# EAGLE design cyrf69103-tinyRF (EAGLE 6.4)
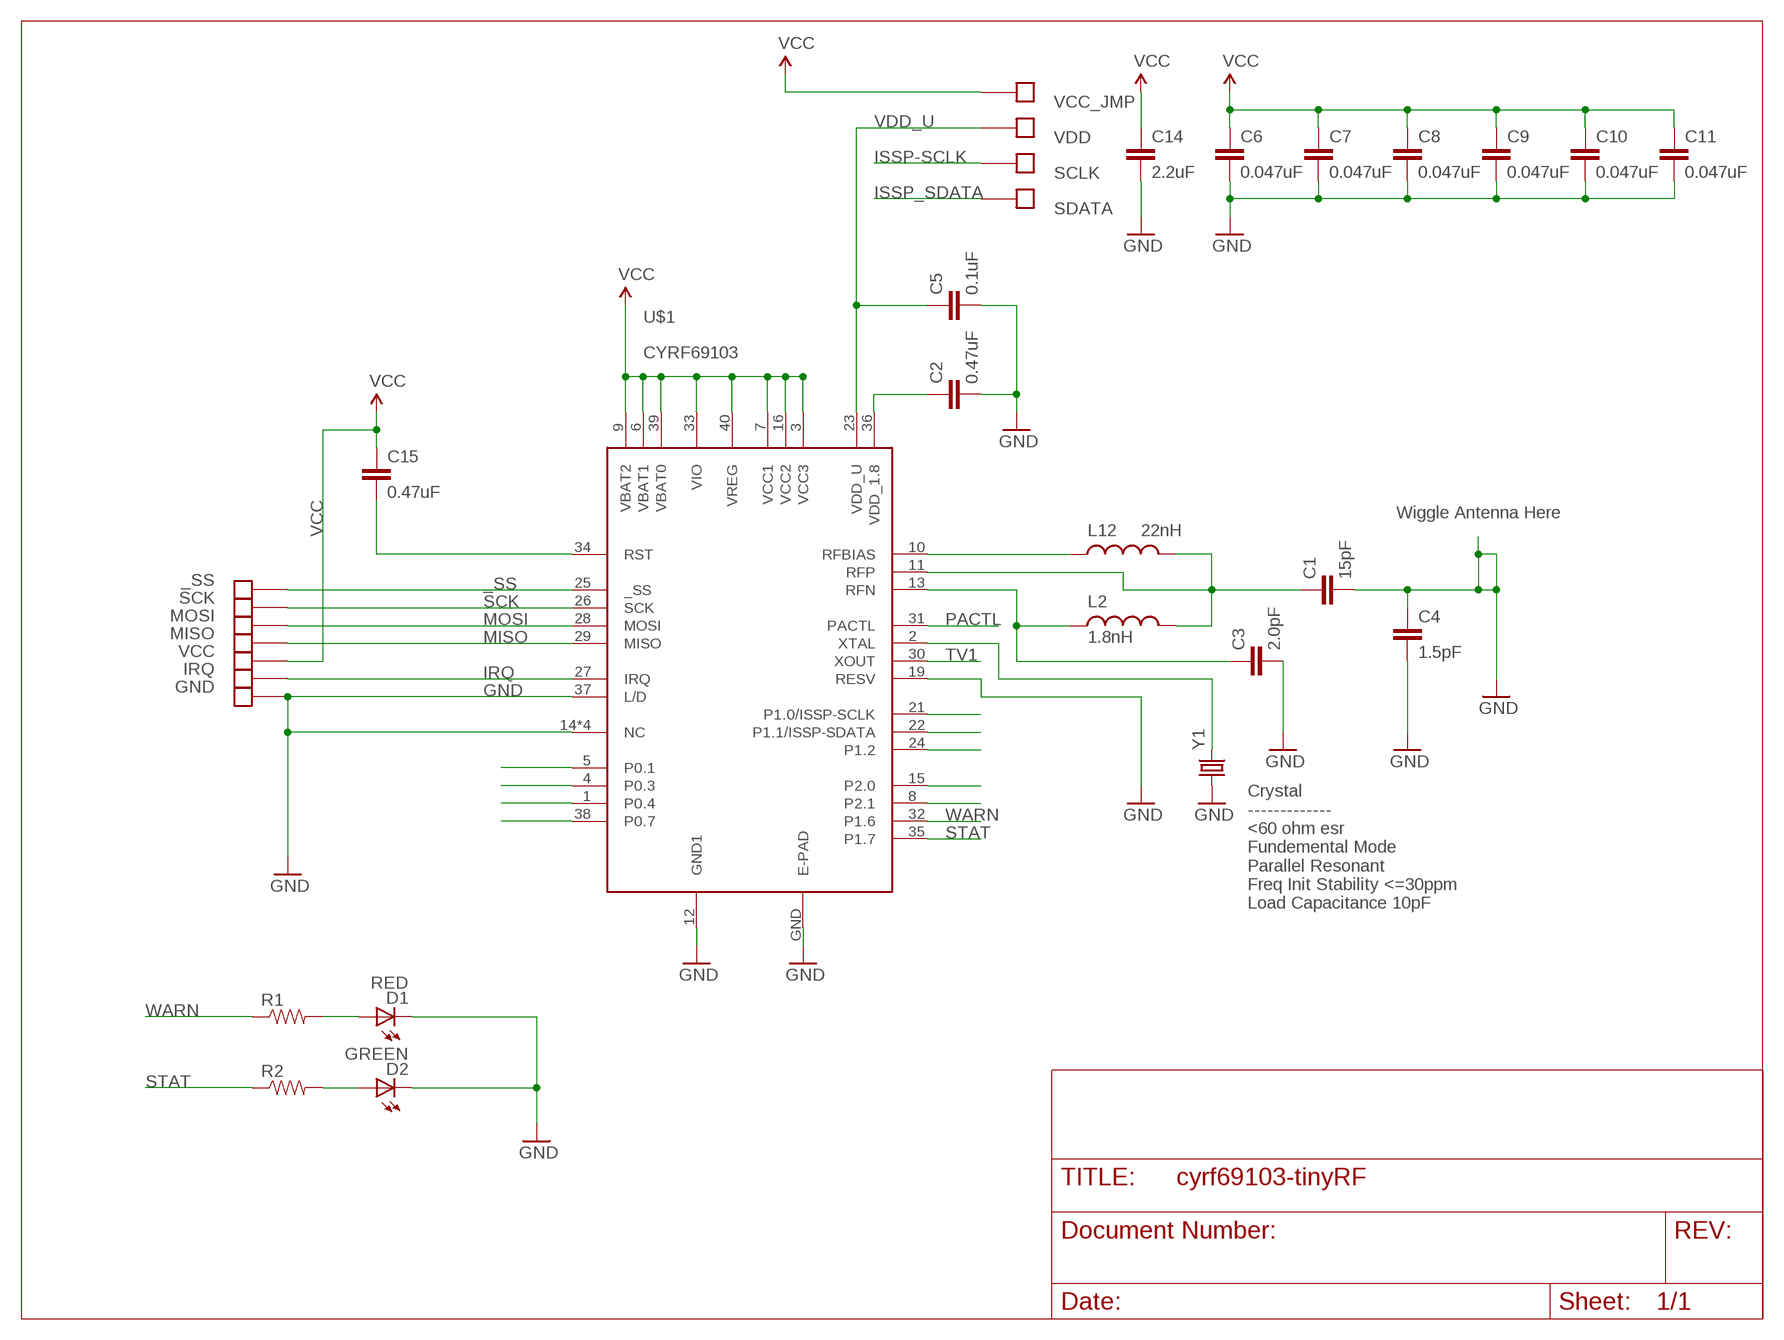
[diagram p0: schematic, sheet 1]

## Parts
_SS  SOLDER_PAD.05X.05  [SOLDER_PAD_.05X.05]
C1  15pF  CAP0402-CAP  [0402-CAP]
C2  0.47uF  CAP0402-CAP  [0402-CAP]
C3  2.0pF  CAP0402-CAP  [0402-CAP]
C4  1.5pF  CAP0402-CAP  [0402-CAP]
C5  0.1uF  CAP0402-CAP  [0402-CAP]
C6  0.047uF  CAP0402-CAP  [0402-CAP]
C7  0.047uF  CAP0402-CAP  [0402-CAP]
C8  0.047uF  CAP0402-CAP  [0402-CAP]
C9  0.047uF  CAP0402-CAP  [0402-CAP]
C10  0.047uF  CAP0402-CAP  [0402-CAP]
C11  0.047uF  CAP0402-CAP  [0402-CAP]
C14  2.2uF  CAP0805  [0805]
C15  0.47uF  CAP0402-CAP  [0402-CAP]
D1  RED  LED-RED0603  [LED-0603]
D2  GREEN  LED-GREEN0603  [LED-0603]
GND  SOLDER_PAD.05X.05  [SOLDER_PAD_.05X.05]
IRQ  SOLDER_PAD.05X.05  [SOLDER_PAD_.05X.05]
L2  1.8nH  INDUCTOR0402  [C0402]
L12  22nH  INDUCTOR0603  [0603]
MISO  SOLDER_PAD.05X.05  [SOLDER_PAD_.05X.05]
MOSI  SOLDER_PAD.05X.05  [SOLDER_PAD_.05X.05]
R1  RESISTOR0402-RES  [0402-RES]
R2  RESISTOR0402-RES  [0402-RES]
SCK  SOLDER_PAD.05X.05  [SOLDER_PAD_.05X.05]
SCLK  SOLDER_PAD.05X.05  [SOLDER_PAD_.05X.05]
SDATA  SOLDER_PAD.05X.05  [SOLDER_PAD_.05X.05]
U$1  CYRF69103  [QFN40]
VCC  SOLDER_PAD.05X.05  [SOLDER_PAD_.05X.05]
VCC_JMP  SOLDER_PAD.05X.05  [SOLDER_PAD_.05X.05]
VDD  SOLDER_PAD.05X.05  [SOLDER_PAD_.05X.05]
Y1  CRYSTAL5X3  [CRYSTAL-SMD-5X3]

## Nets
_SS: _SS.P$1(NET) U$1.25(_SS)
GND: C1.2 C2.2 C3.2 C4.1 C4.2 C5.2 C6.2 C7.2 C8.2 C9.2 C10.2 C11.2 C14.2 D1.C D2.C GND.P$1(NET) U$1.12(GND1) U$1.14(NC) U$1.17(NC) U$1.18(NC) U$1.20(NC) U$1.37(L/D) U$1.GND(E-PAD) Y1.1
IRQ: IRQ.P$1(NET) U$1.27(IRQ)
ISSP-SCLK: SCLK.P$1(NET) U$1.21(P1.0/ISSP-SCLK)
ISSP_SDATA: SDATA.P$1(NET) U$1.22(P1.1/ISSP-SDATA)
MISO: MISO.P$1(NET) U$1.29(MISO)
MOSI: MOSI.P$1(NET) U$1.28(MOSI)
N$1: D1.A R1.2
N$2: U$1.2(XTAL) Y1.3
N$3: U$1.5(P0.1)
N$4: U$1.4(P0.3)
N$5: U$1.1(P0.4)
N$6: U$1.38(P0.7)
N$7: U$1.24(P1.2)
N$8: U$1.15(P2.0)
N$9: U$1.8(P2.1)
N$10: D2.A R2.2
PACTL: U$1.31(PACTL)
RFBIAS: L12.1 U$1.10(RFBIAS)
RFN: C3.1 L2.1 U$1.13(RFN)
RFP: C1.1 L2.2 L12.2 U$1.11(RFP)
RST: C15.2 U$1.34(RST)
SCK: SCK.P$1(NET) U$1.26(SCK)
STAT: R2.1 U$1.35(P1.7)
VCC: C6.1 C7.1 C8.1 C9.1 C10.1 C11.1 C14.1 C15.1 U$1.3(VCC3) U$1.6(VBAT1) U$1.7(VCC1) U$1.9(VBAT2) U$1.16(VCC2) U$1.33(VIO) U$1.39(VBAT0) U$1.40(VREG) VCC.P$1(NET) VCC_JMP.P$1(NET)
VDD_1.8: C2.1 U$1.36(VDD_1.8)
VDD_U: C5.1 U$1.23(VDD_U) VDD.P$1(NET)
WARN: R1.1 U$1.32(P1.6)
Unconnected: U$1.19(RESV) U$1.30(XOUT)

## Notes on the sheet
- Wiggle Antenna Here
- Crystal
  -------------
  <60 ohm esr
  Fundemental Mode
  Parallel Resonant
  Freq Init Stability <=30ppm
  Load Capacitance 10pF

## Library data of the parts
_SS GND IRQ MISO MOSI SCK SCLK SDATA VCC VCC_JMP VDD = JCM:SOLDER_PAD
C1 = SparkFun-Passives:CAP: Capacitor Standard 0603 ceramic capacitor, and 0.1" leaded capacitor.; PARTNO: C0402C150J5GACTU; VOLT: 50
C2 C5 C15 = SparkFun-Passives:CAP: Capacitor Standard 0603 ceramic capacitor, and 0.1" leaded capacitor.; PARTNO: GRM155R60J474KE19D; VOLT: 6.3
C3 = SparkFun-Passives:CAP: Capacitor Standard 0603 ceramic capacitor, and 0.1" leaded capacitor.; PARTNO: C0402C209C5GACTU; VOLT: 50
C4 = SparkFun-Passives:CAP: Capacitor Standard 0603 ceramic capacitor, and 0.1" leaded capacitor.; PARTNO: C0402C159B5GACTU; VOLT: 50
C6-C11 = SparkFun-Passives:CAP: Capacitor Standard 0603 ceramic capacitor, and 0.1" leaded capacitor.; PARTNO: 0402YD473KAT2A
C14 = SparkFun-Passives:CAP: Capacitor Standard 0603 ceramic capacitor, and 0.1" leaded capacitor.; PARTNO: GRM21BR71A225KA01L
D1 = SparkFun-LED:LED-RED: Assorted Red LEDs LilyPad 1206- DIO-09912 1206- DIO-00809 0603- DIO-00819; PROD_ID: DIO-00819
D2 = SparkFun-LED:LED-GREEN: Various green LEDs 0603- DIO-00821 LARGE- DIO-00862 LILYPAD- DIO-09910; PROD_ID: DIO-00821
L2 = SparkFun-Passives:INDUCTOR: Inductors Basic Inductor/Choke - 0603 and 1206. Footprints are not proven and vary greatly between part numbers.; PARTNO: ELJ-RF1N8DFB
L12 = SparkFun-Passives:INDUCTOR: Inductors Basic Inductor/Choke - 0603 and 1206. Footprints are not proven and vary greatly between part numbers.; PARTNO: ELJ-RE22NGFA
R1 R2 = SparkFun-Passives:RESISTOR: Resistor Basic schematic elements and footprints for 0603, 1206, and PTH resistors.
U$1 = JCM:CYRF69103
Y1 = SparkFun-FreqCtrl:CRYSTAL: Various standard crystals. Proven footprints. Spark Fun Electronics SKU : COM-00534; PARTNO: 7B-12.000MEEQ-T

## Board
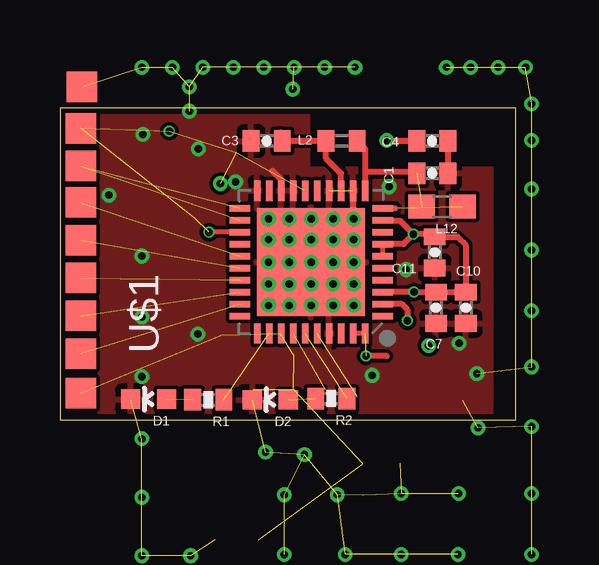
[diagram p1: board, top side]
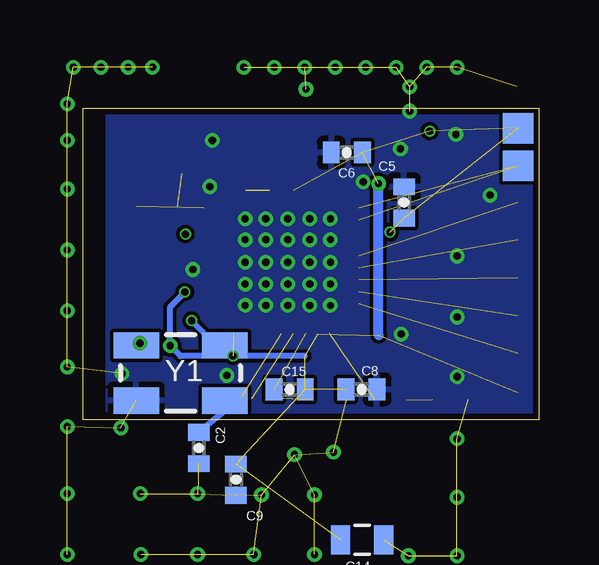
[diagram p2: board, bottom side, seen from below]

Size 19 x 13 mm. Coordinates in mm from the lower left corner, seen from the top.
Outline: 0,0 19,0 19,13 0,13 0,0
Copper layers (1*16): Top 0.035mm / dielectric 1.5mm / Bottom 0.035mm
Design rules "Fusion_eagle_rule_v1.1-JCM-restring *": minimum track width 6mil, minimum drill 12mil, track to track 6mil, track to pad 6mil, pad to pad 6mil, via to via 6mil, smd to smd 0mil, copper to edge 10mil, drill to drill 10mil, minimum pad ring 10mil, minimum via ring 2mil, stop-mask expansion 2mil, vias tented up to drill 100mil, thermal gap 10mil
tRestrict: area 10.4,10.6 to 18.8,14; area 14.1,13.4 to 15.6,15.2
bRestrict: area 14.1,15.1 to 16.9,16.7

### Footprints (pad centres in the part's own frame; a part is rotated, then mirrored left to right if it is on the bottom)
SOLDER_PAD_.05X.05 = smd 1.27 x 1.27: P$1 0,0
0402-CAP = smd 0.7 x 0.9: 1 -0.65,0; 2 0.65,0
0805 = smd 0.8 x 1.2: 1 -0.9,0; 2 0.9,0
LED-0603 = smd 0.8 x 0.8: A 0,-0.75; C 0,0.75
C0402 = smd 0.7 x 0.9: 1 -0.65,0; 2 0.65,0
0603 = smd 1.1 x 1: 1 -0.85,0; 2 0.85,0
0402-RES = smd 0.7 x 0.9: 1 -0.65,0; 2 0.65,0
QFN40 = smd 0.28 x 0.85: 1 -2.25,-2.975; 2 -1.75,-2.975; 3 -1.25,-2.975; 4 -0.75,-2.975; 5 -0.25,-2.975; 6 0.25,-2.975; 7 0.75,-2.975; 8 1.25,-2.975; 9 1.75,-2.975; 10 2.25,-2.975; 21 2.25,2.975; 22 1.75,2.975; 23 1.25,2.975; 24 0.75,2.975; 25 0.25,2.975; 26 -0.25,2.975; 27 -0.75,2.975; 28 -1.25,2.975; 29 -1.75,2.975; 30 -2.25,2.975 | smd 0.85 x 0.28: 11 2.975,-2.25; 12 2.975,-1.75; 13 2.975,-1.25; 14 2.975,-0.75; 15 2.975,-0.25; 16 2.975,0.25; 17 2.975,0.75; 18 2.975,1.25; 19 2.975,1.75; 20 2.975,2.25; 31 -2.975,2.25; 32 -2.975,1.75; 33 -2.975,1.25; 34 -2.975,0.75; 35 -2.975,0.25; 36 -2.975,-0.25; 37 -2.975,-0.75; 38 -2.975,-1.25; 39 -2.975,-1.75; 40 -2.975,-2.25 | smd 4.5 x 4.5: GND 0,0
CRYSTAL-SMD-5X3 = smd 1.9 x 1.1: 1 -1.85,-1.15; 2 1.85,-1.15; 3 1.85,1.15; 4 -1.85,1.15

### Placement (x,y rotation side)
_SS  0.87,9.06 0 top
C1  15.53,10.28 0 top
C2  14.18,-1.17 270 bottom
C3  8.62,11.63 180 top
C4  15.53,11.63 180 top
C5  5.62,9.06 90 bottom
C6  8.01,11.15 180 bottom
C7  15.68,4.67 270 top
C8  7.4,1.27 0 bottom
C9  12.63,-2.49 270 bottom
C10  16.93,4.67 270 top
C11  15.63,6.98 270 top
C14  7.38,-5.01 0 bottom  (outside the outline)
C15  10.4,1.27 180 bottom
D1  3.69,0.86 90 top
D2  8.77,0.83 90 top
GND  0.92,13.89 0 top
IRQ  0.87,5.91 0 top
L2  11.75,11.63 0 top
L12  15.94,8.89 180 top
MISO  0.87,2.76 0 top
MOSI  0.87,4.34 0 top
R1  6.18,0.83 180 top
R2  11.31,0.88 180 top
SCK  0.87,7.49 0 top
SCLK  0.87,10.59 0 top
SDATA  0.87,10.59 0 bottom
U$1  10.48,6.57 90 top
VCC  0.87,1.11 0 top
VCC_JMP  0.87,12.16 0 bottom
VDD  0.87,12.16 0 top
Y1  14.95,1.95 0 bottom

### Tracks (layer width: path | path; a pad name or v marks a point on that pad's centre or on a via)
_SS  (1 unrouted)
GND  (via drill 0.3 pad 0.61)  (43 unrouted)
  Top 0.254: 9.23,10.01 8.85,10.38 | 8.24,9.56 U$1.20 | U$1.14 11.23,9.84 | U$1.12 12.23,8.41 v12.25,8.38 | C4.1 C1.2 | C4.2 13.65,11.63 v13.62,11.65
  other vias: 5.75,3.58 16.65,3.2 12.25,6.57 11.39,6.57 10.48,6.57 9.56,6.57 8.7,6.57 12.25,5.66 11.39,5.66 10.48,5.66 9.56,5.66 8.7,5.66 12.25,4.77 11.39,4.77 10.48,4.77 9.56,4.77 8.7,4.77 9.56,7.51 8.7,7.51 8.7,8.38 5.78,11.3 11.57,-3.13 10.2,-1.45 3.41,-3.23 3.41,-0.79 3.41,1.8 3.41,4.29 3.41,6.83 2.04,9.37 3.41,14.7 3.41,-5.67 17.13,14.7 16.11,14.7 12.3,14.7 11.03,14.7 4.68,14.7 9.76,14.7 8.49,14.7 7.22,14.7 5.95,14.7 19.42,14.7 16.6,-5.62 18.27,14.7 5.45,-5.67 9.36,-5.62 11.9,-5.62 9.36,-3.13 14.23,-5.62 7.33,9.93 5.4,12.87 5.4,13.89 17.38,1.93 14.23,-3.08 16.62,-3.08 9.71,13.79 3.46,11.91 13.73,9.72 19.67,-3.08 19.67,-0.28 19.67,2.21 19.67,4.54 19.67,7.08 19.67,9.62 19.67,-5.62 19.67,11.65 19.67,13.18 17.43,-0.33 8.57,-1.35 13.02,1.85 10.48,7.51 11.39,7.51 12.25,7.51 9.56,8.38 10.48,8.38 11.39,8.38 14.44,6.27
  pour Bottom: 0,0 18,0 18,13 0,13
  pour Top (rank 2): 0,0 18,0 18,13 0,13
IRQ  (1 unrouted)
ISSP-SCLK  (1 unrouted)
ISSP_SDATA  (1 unrouted)
MISO  (1 unrouted)
MOSI  (1 unrouted)
N$1  (1 unrouted)
N$2  (via drill 0.3)
  Top 0.254: U$1.2 14.26,4.82 14.49,4.59 v14.49,4.14
  Bottom 0.254: v14.49,4.14 13.45,3.1 Y1.3
N$10  (1 unrouted)
RFBIAS  (1 unrouted)
  Top 0.254: U$1.10 13.98,8.82
RFN
  Top 0.254: 9.2,11.98 C3.1 L2.1 11.1,10.9 11.73,10.27 U$1.13
RFP  (1 unrouted)
  Top 0.254: L2.2 12.73,11.3 12.73,10.33 | 12.73,10.33 U$1.11 | 12.73,10.33 14.83,10.33 C1.1 14.89,10.27
RST  (1 unrouted)
  Top 0.254: U$1.34 9.71,3.59
SCK  (1 unrouted)
STAT  (1 unrouted)
VCC  (via drill 0.3, 0.3 pad 0.61)  (12 unrouted)
  Top 0.203: U$1.9 13.47,8.3 | U$1.7 U$1.6 | U$1.40 U$1.39
  Top 0.254: U$1.33 9.2,3.58 | 13.62,2.66 v12.76,2.66 | 13.47,8.3 14.18,8.3 v14.74,7.74 | v14.74,7.74 14.32,7.32 U$1.7 | 13.48,5.32 13.47,5.3 U$1.3 v14.77,5.33 14.78,5.32 C7.1 C10.1 16.93,7.29 16.58,7.63 C11.1 15.52,7.74 v14.74,7.74
  Bottom 0.254: 9.76,2.66 v12.76,2.66 14.95,2.66 v15.38,3.09 15.38,4.71 14.77,5.32 v14.77,5.33 | v14.74,7.74 14.77,7.72
  Bottom 0.406: 6.69,3.53 v6.69,9.85
  other vias: 4.56,12.04
VDD_1.8  (1 unrouted)
  Bottom 0.254: 12.41,0.95 C2.1
VDD_U  (via drill 0.3)  (2 unrouted)
  Top 0.203: U$1.23 v6.21,7.82
WARN  (1 unrouted)

### Text on the board
tDocu: CYRF6936-BoB v0.1
bDocu: J Moreland Engineering LLC / 18 Apr 2013